# EasyEDA Pro project 嵌入式STC51测电压工程_2024_11_11.epro, schematic 51单片机课设测电压简单版本
Board Name: Board1; Create Date: 2024-11-16
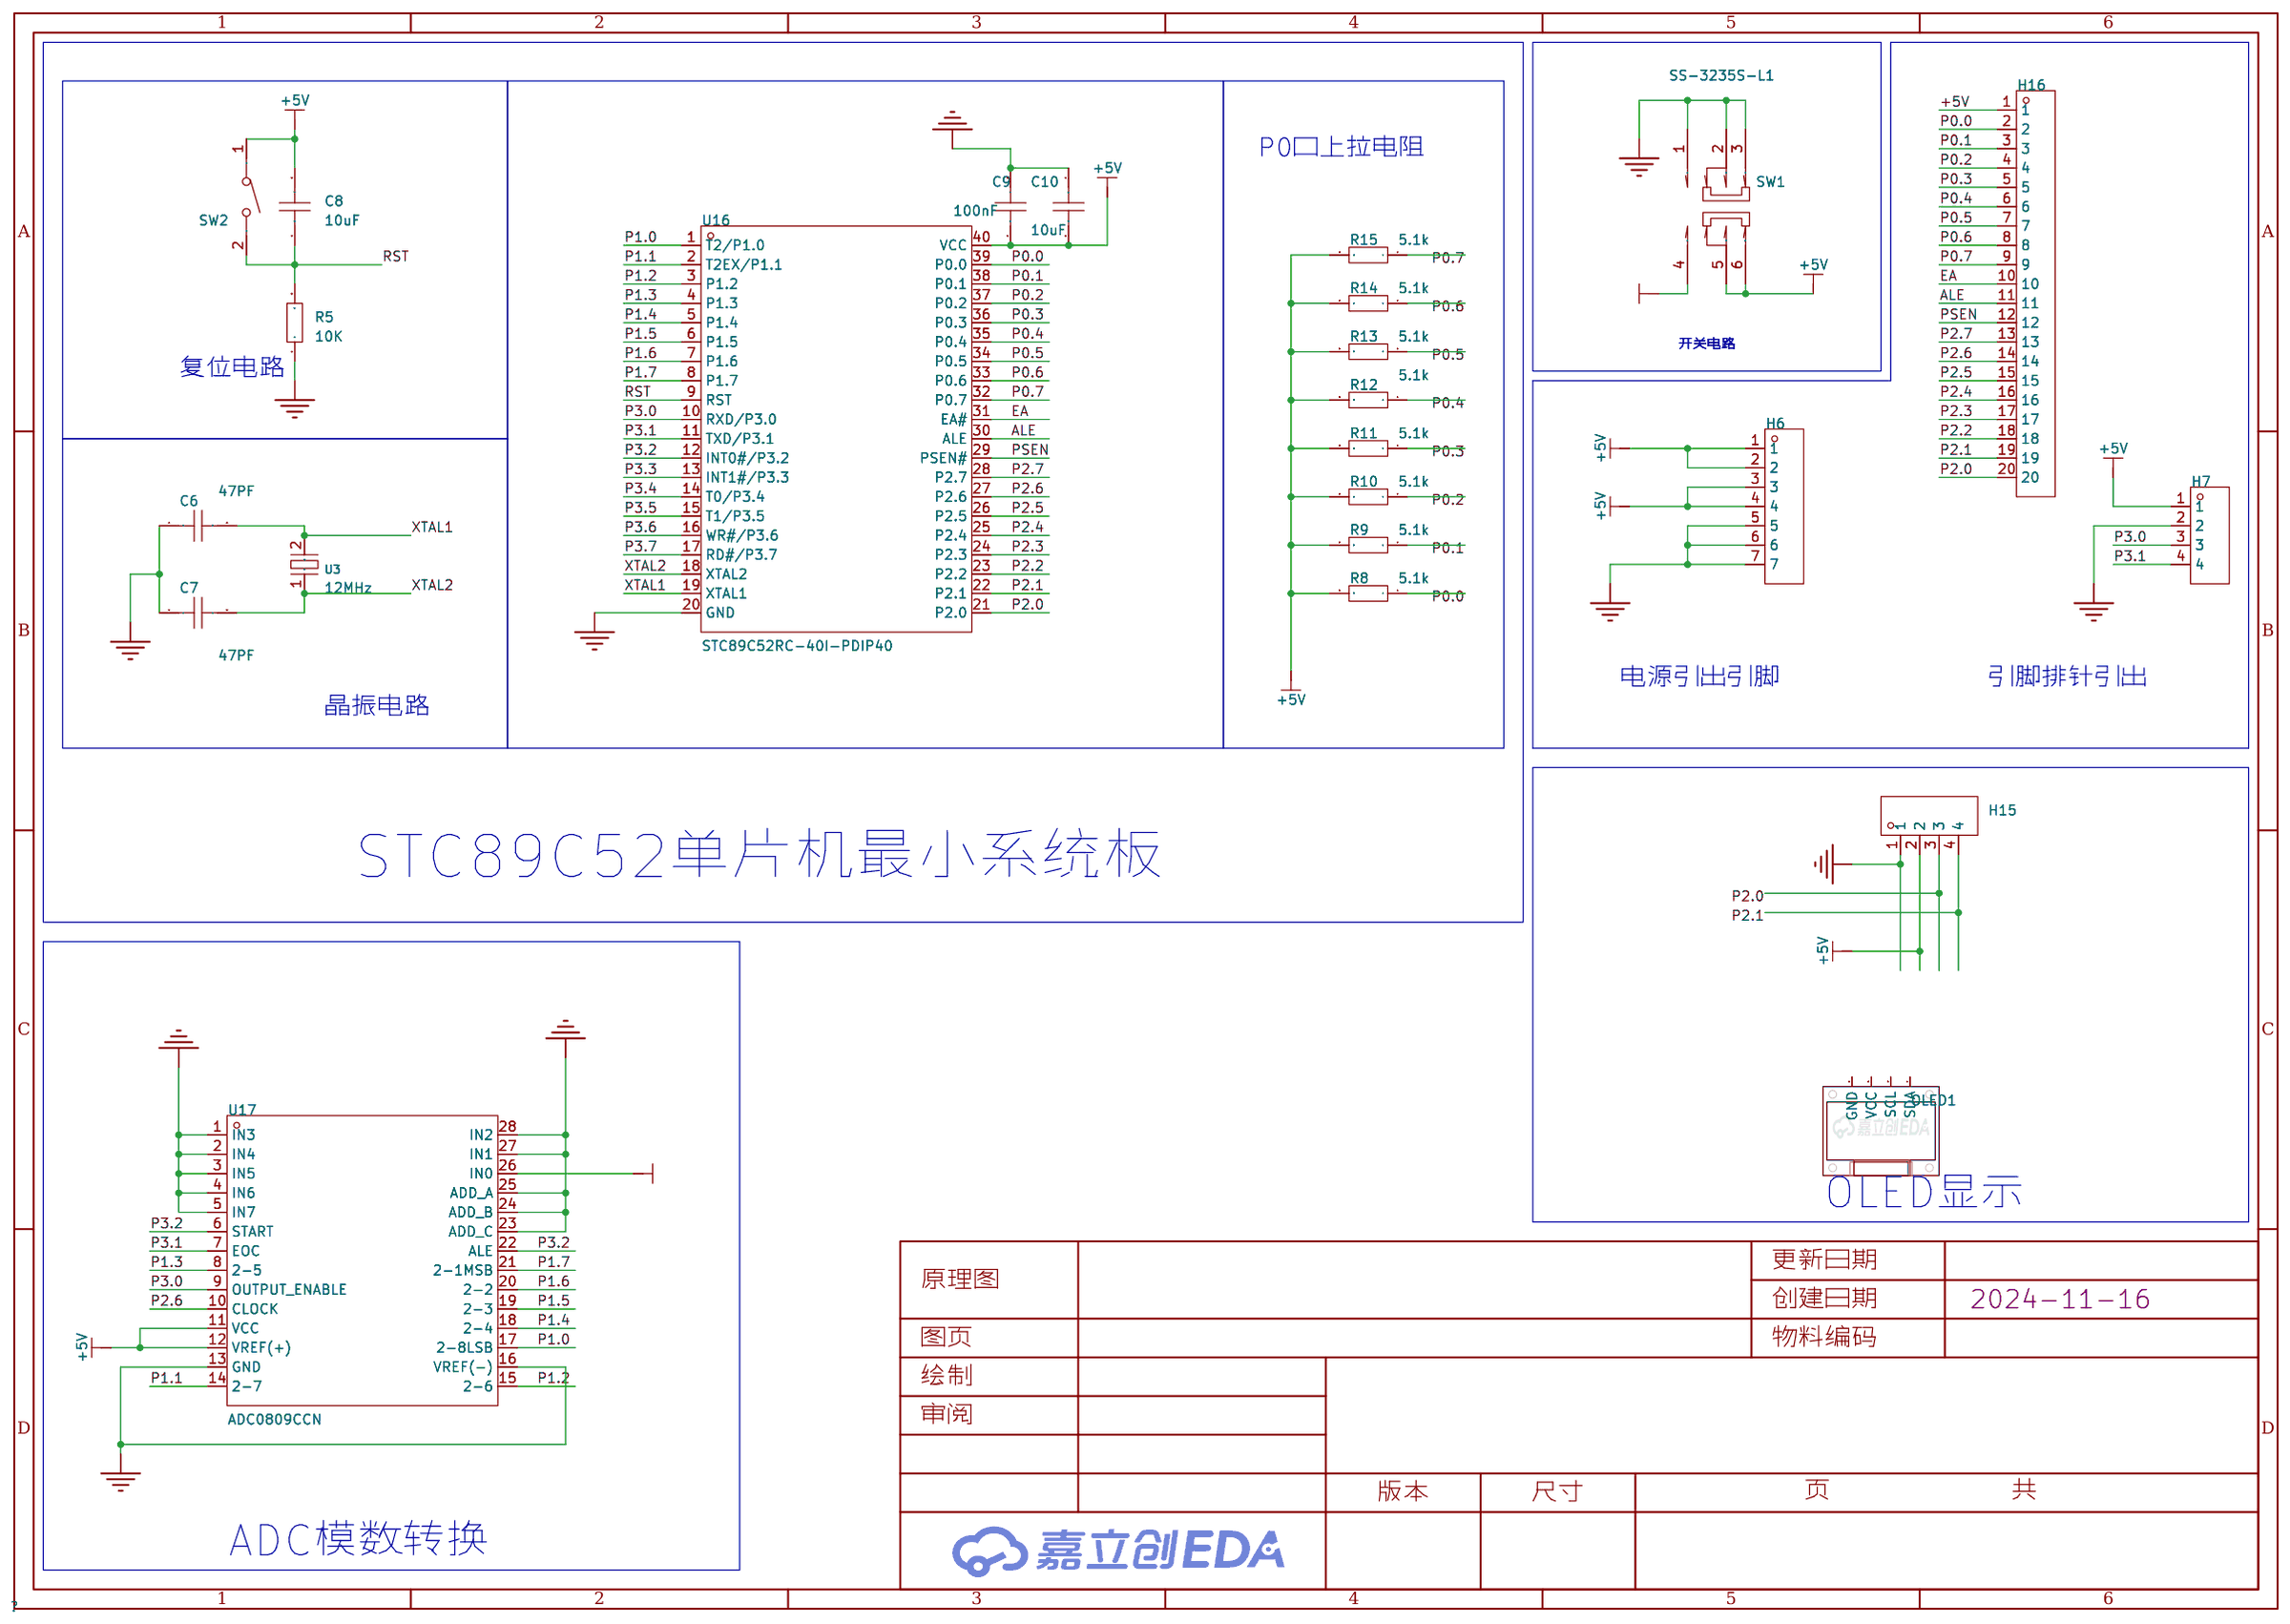
[diagram p0: schematic sheet]

## Parts
C6  47PF  [C0805]
C7  47PF  [C0805]
C8  10uF  [C0805]
C9  100nF  [C0805]
C10  10uF  [C0805]
H6  -  [HDR-TH_7P-P2.54-V-M]
H7  -  [HDR-TH_4P-P2.54-V-M]
H15  -  [hdr-th_4p-p2.54-v-f]
H16  -  [HDR-TH_20P-P2.54-V-M-1]
OLED1  -  [0.96OLED_4P]
R5  10K  [R0805]
R8  5.1k  [R0805]
R9  5.1k  [R0805]
R10  5.1k  [R0805]
R11  5.1k  [R0805]
R12  5.1k  [R0805]
R13  5.1k  [R0805]
R14  5.1k  [R0805]
R15  5.1k  [R0805]
SW1  SS-3235S-L1  [SW-SMD_SS-3235S-LX]
SW2  轻触按键3*4*H  [SW-SMD_L4.0-W2.9-LS5.0]
U3  12MHz  [CRYSTAL-SMD_L11.4-W4.7-LS12.7]
U16  STC89C52RC-40I-PDIP40  [DIP-40_L52.0-W13.7-P2.54-LS15.2-BL]
U17  ADC0809CCN  [PDIP-28_L36.0-W13.0-P2.54-LS15.5-BL]

## Library data of the parts
C6-C10 = CAP_0805: Supplier Footprint: 0805
H6 = HDR-M_2.54_1x7P: Supplier Part: C492406; Supplier Footprint: 插件
H7 = HDR-M_2.54_1x4P: Supplier Part: C492403; Supplier Footprint: 插件
H15 = HDR-F_2.54_1x4P: Supplier Part: C2718488; Supplier Footprint: 插件; JLCPCB Part Class: 扩展库
H16 = HDR-M_2.54_1x20P: 间距:2.54mm;总PIN位数:20;排数:1;插针结构:-;行距:-;安装类型:直插;圆针/方针:-;额定电流:-;额定电压:-;配合针长度:-;塑高:-;触头材质:黄铜;触头镀层:-;颜色:黑色;; Supplier Part: C50981; Supplier Footprint: 插件
